# Altium schematic sheet 04 - Display.SchDoc
size A4; SheetNumber: 3; SheetTotal: 4; SchemaTitle: Overview
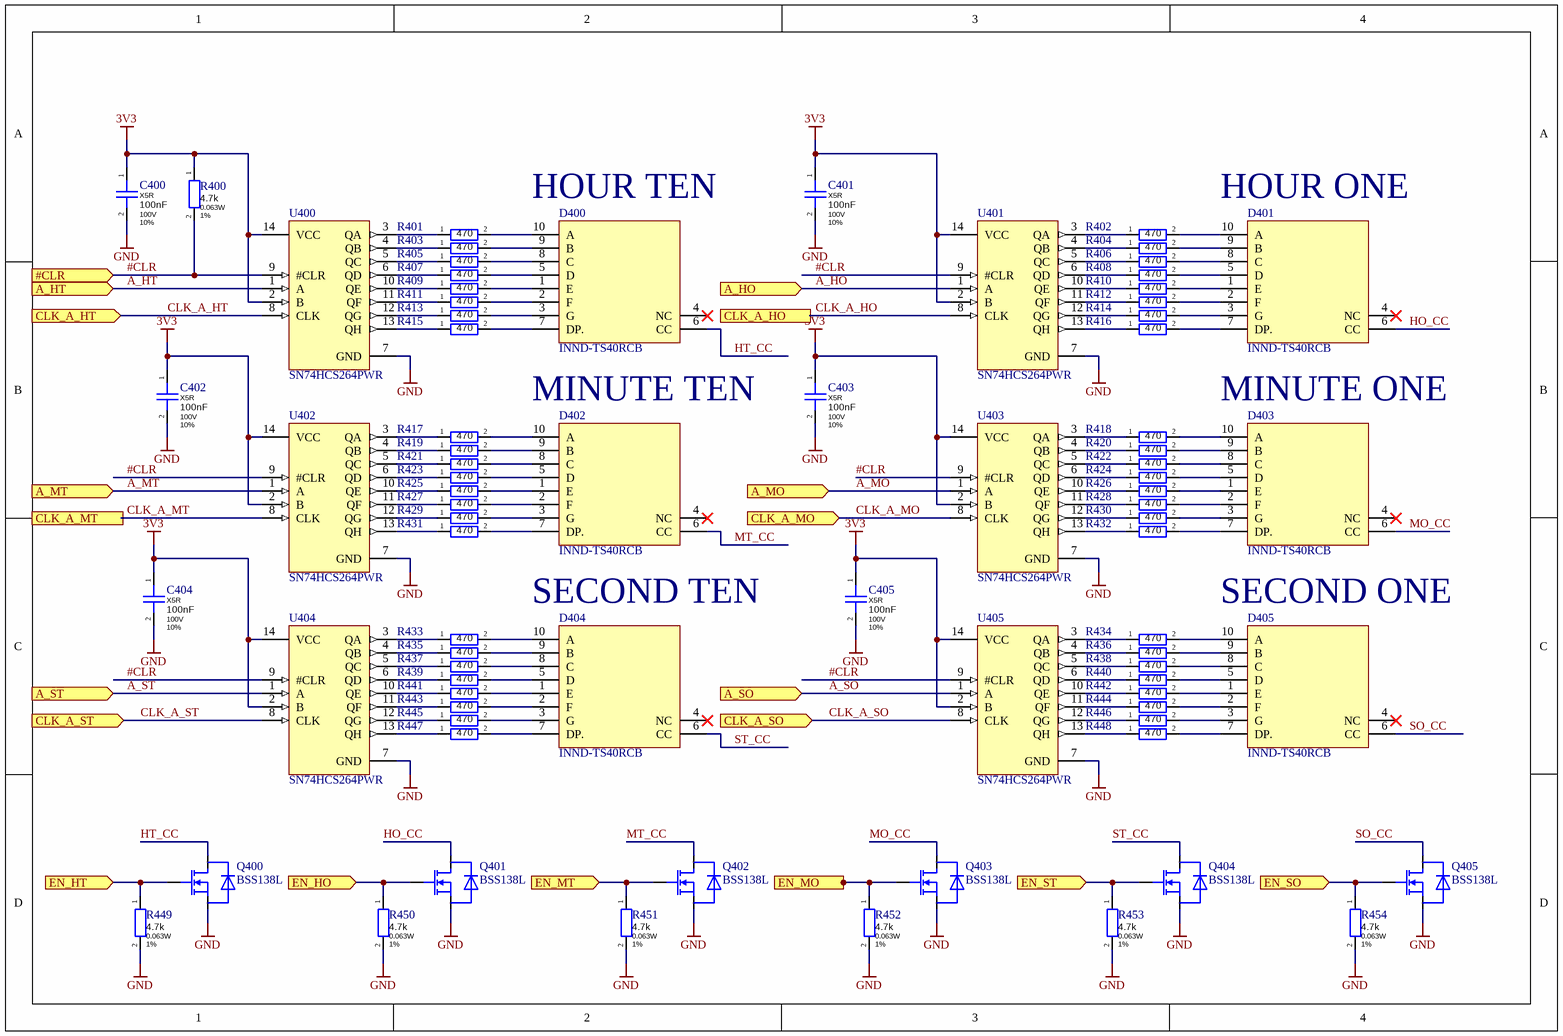
[diagram p0: 04 - Display.SchDoc]

## Parts
C400  Dielectric: X5R  Capacitance: 100nF  Voltage Rating: 100V  Tolerance: 10%  [CAPC0402(1005)60_L]  (hidden comment: GRM155R62A104KE14D)
C401  Dielectric: X5R  Capacitance: 100nF  Voltage Rating: 100V  Tolerance: 10%  [CAPC0402(1005)60_L]  (hidden comment: GRM155R62A104KE14D)
C402  Dielectric: X5R  Capacitance: 100nF  Voltage Rating: 100V  Tolerance: 10%  [CAPC0402(1005)60_L]  (hidden comment: GRM155R62A104KE14D)
C403  Dielectric: X5R  Capacitance: 100nF  Voltage Rating: 100V  Tolerance: 10%  [CAPC0402(1005)60_L]  (hidden comment: GRM155R62A104KE14D)
C404  Dielectric: X5R  Capacitance: 100nF  Voltage Rating: 100V  Tolerance: 10%  [CAPC0402(1005)60_L]  (hidden comment: GRM155R62A104KE14D)
C405  Dielectric: X5R  Capacitance: 100nF  Voltage Rating: 100V  Tolerance: 10%  [CAPC0402(1005)60_L]  (hidden comment: GRM155R62A104KE14D)
D400  INND-TS40RCB  [INND-TS40RCB-Footprint-1]
D401  INND-TS40RCB  [INND-TS40RCB-Footprint-1]
D402  INND-TS40RCB  [INND-TS40RCB-Footprint-1]
D403  INND-TS40RCB  [INND-TS40RCB-Footprint-1]
D404  INND-TS40RCB  [INND-TS40RCB-Footprint-1]
D405  INND-TS40RCB  [INND-TS40RCB-Footprint-1]
Q400  BSS138L  [SOT23-3]
Q401  BSS138L  [SOT23-3]
Q402  BSS138L  [SOT23-3]
Q403  BSS138L  [SOT23-3]
Q404  BSS138L  [SOT23-3]
Q405  BSS138L  [SOT23-3]
R400  Resistance: 4.7k  Power Rating: 0.063W  Tolerance: 1%  [RESC0402(1005)_L]  (hidden comment: RMCF0402FT4K70)
R401  Resistance: 470  [RESC0402(1005)_L]  (hidden comment: RMCF0402FT470R)
R402  Resistance: 470  [RESC0402(1005)_L]  (hidden comment: RMCF0402FT470R)
R403  Resistance: 470  [RESC0402(1005)_L]  (hidden comment: RMCF0402FT470R)
R404  Resistance: 470  [RESC0402(1005)_L]  (hidden comment: RMCF0402FT470R)
R405  Resistance: 470  [RESC0402(1005)_L]  (hidden comment: RMCF0402FT470R)
R406  Resistance: 470  [RESC0402(1005)_L]  (hidden comment: RMCF0402FT470R)
R407  Resistance: 470  [RESC0402(1005)_L]  (hidden comment: RMCF0402FT470R)
R408  Resistance: 470  [RESC0402(1005)_L]  (hidden comment: RMCF0402FT470R)
R409  Resistance: 470  [RESC0402(1005)_L]  (hidden comment: RMCF0402FT470R)
R410  Resistance: 470  [RESC0402(1005)_L]  (hidden comment: RMCF0402FT470R)
R411  Resistance: 470  [RESC0402(1005)_L]  (hidden comment: RMCF0402FT470R)
R412  Resistance: 470  [RESC0402(1005)_L]  (hidden comment: RMCF0402FT470R)
R413  Resistance: 470  [RESC0402(1005)_L]  (hidden comment: RMCF0402FT470R)
R414  Resistance: 470  [RESC0402(1005)_L]  (hidden comment: RMCF0402FT470R)
R415  Resistance: 470  [RESC0402(1005)_L]  (hidden comment: RMCF0402FT470R)
R416  Resistance: 470  [RESC0402(1005)_L]  (hidden comment: RMCF0402FT470R)
R417  Resistance: 470  [RESC0402(1005)_L]  (hidden comment: RMCF0402FT470R)
R418  Resistance: 470  [RESC0402(1005)_L]  (hidden comment: RMCF0402FT470R)
R419  Resistance: 470  [RESC0402(1005)_L]  (hidden comment: RMCF0402FT470R)
R420  Resistance: 470  [RESC0402(1005)_L]  (hidden comment: RMCF0402FT470R)
R421  Resistance: 470  [RESC0402(1005)_L]  (hidden comment: RMCF0402FT470R)
R422  Resistance: 470  [RESC0402(1005)_L]  (hidden comment: RMCF0402FT470R)
R423  Resistance: 470  [RESC0402(1005)_L]  (hidden comment: RMCF0402FT470R)
R424  Resistance: 470  [RESC0402(1005)_L]  (hidden comment: RMCF0402FT470R)
R425  Resistance: 470  [RESC0402(1005)_L]  (hidden comment: RMCF0402FT470R)
R426  Resistance: 470  [RESC0402(1005)_L]  (hidden comment: RMCF0402FT470R)
R427  Resistance: 470  [RESC0402(1005)_L]  (hidden comment: RMCF0402FT470R)
R428  Resistance: 470  [RESC0402(1005)_L]  (hidden comment: RMCF0402FT470R)
R429  Resistance: 470  [RESC0402(1005)_L]  (hidden comment: RMCF0402FT470R)
R430  Resistance: 470  [RESC0402(1005)_L]  (hidden comment: RMCF0402FT470R)
R431  Resistance: 470  [RESC0402(1005)_L]  (hidden comment: RMCF0402FT470R)
R432  Resistance: 470  [RESC0402(1005)_L]  (hidden comment: RMCF0402FT470R)
R433  Resistance: 470  [RESC0402(1005)_L]  (hidden comment: RMCF0402FT470R)
R434  Resistance: 470  [RESC0402(1005)_L]  (hidden comment: RMCF0402FT470R)
R435  Resistance: 470  [RESC0402(1005)_L]  (hidden comment: RMCF0402FT470R)
R436  Resistance: 470  [RESC0402(1005)_L]  (hidden comment: RMCF0402FT470R)
R437  Resistance: 470  [RESC0402(1005)_L]  (hidden comment: RMCF0402FT470R)
R438  Resistance: 470  [RESC0402(1005)_L]  (hidden comment: RMCF0402FT470R)
R439  Resistance: 470  [RESC0402(1005)_L]  (hidden comment: RMCF0402FT470R)
R440  Resistance: 470  [RESC0402(1005)_L]  (hidden comment: RMCF0402FT470R)
R441  Resistance: 470  [RESC0402(1005)_L]  (hidden comment: RMCF0402FT470R)
R442  Resistance: 470  [RESC0402(1005)_L]  (hidden comment: RMCF0402FT470R)
R443  Resistance: 470  [RESC0402(1005)_L]  (hidden comment: RMCF0402FT470R)
R444  Resistance: 470  [RESC0402(1005)_L]  (hidden comment: RMCF0402FT470R)
R445  Resistance: 470  [RESC0402(1005)_L]  (hidden comment: RMCF0402FT470R)
R446  Resistance: 470  [RESC0402(1005)_L]  (hidden comment: RMCF0402FT470R)
R447  Resistance: 470  [RESC0402(1005)_L]  (hidden comment: RMCF0402FT470R)
R448  Resistance: 470  [RESC0402(1005)_L]  (hidden comment: RMCF0402FT470R)
R449  Resistance: 4.7k  Power Rating: 0.063W  Tolerance: 1%  [RESC0402(1005)_L]  (hidden comment: RMCF0402FT4K70)
R450  Resistance: 4.7k  Power Rating: 0.063W  Tolerance: 1%  [RESC0402(1005)_L]  (hidden comment: RMCF0402FT4K70)
R451  Resistance: 4.7k  Power Rating: 0.063W  Tolerance: 1%  [RESC0402(1005)_L]  (hidden comment: RMCF0402FT4K70)
R452  Resistance: 4.7k  Power Rating: 0.063W  Tolerance: 1%  [RESC0402(1005)_L]  (hidden comment: RMCF0402FT4K70)
R453  Resistance: 4.7k  Power Rating: 0.063W  Tolerance: 1%  [RESC0402(1005)_L]  (hidden comment: RMCF0402FT4K70)
R454  Resistance: 4.7k  Power Rating: 0.063W  Tolerance: 1%  [RESC0402(1005)_L]  (hidden comment: RMCF0402FT4K70)
U400  SN74HCS264PWR  [TSSOP-14]
U401  SN74HCS264PWR  [TSSOP-14]
U402  SN74HCS264PWR  [TSSOP-14]
U403  SN74HCS264PWR  [TSSOP-14]
U404  SN74HCS264PWR  [TSSOP-14]
U405  SN74HCS264PWR  [TSSOP-14]

## Ports
#CLR (in), A_HO (in), A_HT (in), A_MO (in), A_MT (in), A_SO (in), A_ST (in), CLK_A_HO (in), CLK_A_HT (in), CLK_A_MO (in), CLK_A_MT (in), CLK_A_SO (in), CLK_A_ST (in), EN_HO (in), EN_HT (in), EN_MO (in), EN_MT (in), EN_SO (in), EN_ST (in)

## Nets
3V3: C400.1 C401.1 C402.1 C403.1 C404.1 C405.1 R400.1 U400.2(B) U400.14(VCC) U401.2(B) U401.14(VCC) U402.2(B) U402.14(VCC) U403.2(B) U403.14(VCC) U404.2(B) U404.14(VCC) U405.2(B) U405.14(VCC)
GND: C400.2 C401.2 C402.2 C403.2 C404.2 C405.2 Q400.2(S) Q401.2(S) Q402.2(S) Q403.2(S) Q404.2(S) Q405.2(S) R449.2 R450.2 R451.2 R452.2 R453.2 R454.2 U400.7(GND) U401.7(GND) U402.7(GND) U403.7(GND) U404.7(GND) U405.7(GND)
#CLR: R400.2 U400.9(#CLR) U401.9(#CLR) U402.9(#CLR) U403.9(#CLR) U404.9(#CLR) U405.9(#CLR) ; port #CLR
A_HO: U401.1(A) ; port A_HO
A_HT: U400.1(A) ; port A_HT
A_MO: U403.1(A) ; port A_MO
A_MT: U402.1(A) ; port A_MT
A_SO: U405.1(A) ; port A_SO
A_ST: U404.1(A) ; port A_ST
CLK_A_HO: U401.8(CLK) ; port CLK_A_HO
CLK_A_HT: U400.8(CLK) ; port CLK_A_HT
CLK_A_MO: U403.8(CLK) ; port CLK_A_MO
CLK_A_MT: U402.8(CLK) ; port CLK_A_MT
CLK_A_SO: U405.8(CLK) ; port CLK_A_SO
CLK_A_ST: U404.8(CLK) ; port CLK_A_ST
EN_HO: Q401.1(G) R450.1 ; port EN_HO
EN_HT: Q400.1(G) R449.1 ; port EN_HT
EN_MO: Q403.1(G) R452.1 ; port EN_MO
EN_MT: Q402.1(G) R451.1 ; port EN_MT
EN_SO: Q405.1(G) R454.1 ; port EN_SO
EN_ST: Q404.1(G) R453.1 ; port EN_ST
HO_CC: D401.6(CC) Q401.3(D)
HT_CC: D400.6(CC) Q400.3(D)
MO_CC: D403.6(CC) Q403.3(D)
MT_CC: D402.6(CC) Q402.3(D)
SO_CC: D405.6(CC) Q405.3(D)
ST_CC: D404.6(CC) Q404.3(D)
NetD400_1: D400.1(E) R409.2
NetD400_2: D400.2(F) R411.2
NetD400_3: D400.3(G) R413.2
NetD400_5: D400.5(D) R407.2
NetD400_7: D400.7(DP.) R415.2
NetD400_8: D400.8(C) R405.2
NetD400_9: D400.9(B) R403.2
NetD400_10: D400.10(A) R401.2
NetD401_1: D401.1(E) R410.2
NetD401_2: D401.2(F) R412.2
NetD401_3: D401.3(G) R414.2
NetD401_5: D401.5(D) R408.2
NetD401_7: D401.7(DP.) R416.2
NetD401_8: D401.8(C) R406.2
NetD401_9: D401.9(B) R404.2
NetD401_10: D401.10(A) R402.2
NetD402_1: D402.1(E) R425.2
NetD402_2: D402.2(F) R427.2
NetD402_3: D402.3(G) R429.2
NetD402_5: D402.5(D) R423.2
NetD402_7: D402.7(DP.) R431.2
NetD402_8: D402.8(C) R421.2
NetD402_9: D402.9(B) R419.2
NetD402_10: D402.10(A) R417.2
NetD403_1: D403.1(E) R426.2
NetD403_2: D403.2(F) R428.2
NetD403_3: D403.3(G) R430.2
NetD403_5: D403.5(D) R424.2
NetD403_7: D403.7(DP.) R432.2
NetD403_8: D403.8(C) R422.2
NetD403_9: D403.9(B) R420.2
NetD403_10: D403.10(A) R418.2
NetD404_1: D404.1(E) R441.2
NetD404_2: D404.2(F) R443.2
NetD404_3: D404.3(G) R445.2
NetD404_5: D404.5(D) R439.2
NetD404_7: D404.7(DP.) R447.2
NetD404_8: D404.8(C) R437.2
NetD404_9: D404.9(B) R435.2
NetD404_10: D404.10(A) R433.2
NetD405_1: D405.1(E) R442.2
NetD405_2: D405.2(F) R444.2
NetD405_3: D405.3(G) R446.2
NetD405_5: D405.5(D) R440.2
NetD405_7: D405.7(DP.) R448.2
NetD405_8: D405.8(C) R438.2
NetD405_9: D405.9(B) R436.2
NetD405_10: D405.10(A) R434.2
NetR401_1: R401.1 U400.3(QA)
NetR402_1: R402.1 U401.3(QA)
NetR403_1: R403.1 U400.4(QB)
NetR404_1: R404.1 U401.4(QB)
NetR405_1: R405.1 U400.5(QC)
NetR406_1: R406.1 U401.5(QC)
NetR407_1: R407.1 U400.6(QD)
NetR408_1: R408.1 U401.6(QD)
NetR409_1: R409.1 U400.10(QE)
NetR410_1: R410.1 U401.10(QE)
NetR411_1: R411.1 U400.11(QF)
NetR412_1: R412.1 U401.11(QF)
NetR413_1: R413.1 U400.12(QG)
NetR414_1: R414.1 U401.12(QG)
NetR415_1: R415.1 U400.13(QH)
NetR416_1: R416.1 U401.13(QH)
NetR417_1: R417.1 U402.3(QA)
NetR418_1: R418.1 U403.3(QA)
NetR419_1: R419.1 U402.4(QB)
NetR420_1: R420.1 U403.4(QB)
NetR421_1: R421.1 U402.5(QC)
NetR422_1: R422.1 U403.5(QC)
NetR423_1: R423.1 U402.6(QD)
NetR424_1: R424.1 U403.6(QD)
NetR425_1: R425.1 U402.10(QE)
NetR426_1: R426.1 U403.10(QE)
NetR427_1: R427.1 U402.11(QF)
NetR428_1: R428.1 U403.11(QF)
NetR429_1: R429.1 U402.12(QG)
NetR430_1: R430.1 U403.12(QG)
NetR431_1: R431.1 U402.13(QH)
NetR432_1: R432.1 U403.13(QH)
NetR433_1: R433.1 U404.3(QA)
NetR434_1: R434.1 U405.3(QA)
NetR435_1: R435.1 U404.4(QB)
NetR436_1: R436.1 U405.4(QB)
NetR437_1: R437.1 U404.5(QC)
NetR438_1: R438.1 U405.5(QC)
NetR439_1: R439.1 U404.6(QD)
NetR440_1: R440.1 U405.6(QD)
NetR441_1: R441.1 U404.10(QE)
NetR442_1: R442.1 U405.10(QE)
NetR443_1: R443.1 U404.11(QF)
NetR444_1: R444.1 U405.11(QF)
NetR445_1: R445.1 U404.12(QG)
NetR446_1: R446.1 U405.12(QG)
NetR447_1: R447.1 U404.13(QH)
NetR448_1: R448.1 U405.13(QH)

Not connected (* = marked no-connect by the designer): D400 4(NC)*; D401 4(NC)*; D402 4(NC)*; D403 4(NC)*; D404 4(NC)*; D405 4(NC)*

## Notes on the sheet
- (near D400) HOUR TEN
- (near D401) HOUR ONE
- MINUTE TEN
- MINUTE ONE
- SECOND TEN
- SECOND ONE
- Schema Title:
- Project:
- Revision:
- Author:
- PCB Name:
- Date:
- Time:
- Sheet:
- of
- Doc Name:
- A4

## Library data of the parts
C400-C405 = CMP-00636-01: 0.1µF ±10% 100V Ceramic Capacitor X5R 0402 (1005 Metric); Manufacturer: Murata Electronics; RoHS Compliant: Yes; Mount: Surface Mount; Max Operating Temperature: 85°C; Min Operating Temperature: -55°C; Supplier Part Number 1: 490-10458-1-ND; Case/Package: 0402; Length: 0.039inch; Manufacturer Part Number: GRM155R62A104KE14D; Termination: SMD/SMT; Thickness: 0.022inch; ComponentLink1Description: Datasheet; Packaging: Tape and Reel; Height: 0.5mm; Package Quantity: 10000; Supplier 1: Digi-Key; Case Code (Imperial): 0402; Lead Free: Lead Free; Case Code (Metric): 1005; Voltage Rating (DC): 100V; Width: 0.5mm; Weight: 0.000212oz; REACH SVHC: No SVHC
D400-D405 = CMP-02011-01: Display Modules - LED Character and Numeric Red 7-Segment 1 Character Common Cathode 2V 20mA 0.508" H x 0.379" W x 0.250" D (12.90mm x 9.63mm x 6.36mm) 10-DIP (0.300", 7.62mm); Manufacturer: Inolux; ComponentLink1URL: https://www.inolux-corp.com/datasheet/Display/Through-Hole-Display/SingleDigit/INND-TS40%20Series_V1.0.pdf; Supplier Part Number 1: 1830-1155-ND; Supplier 1: Digi-Key; Manufacturer Part Number: INND-TS40RCB; ComponentLink1Description: Datasheet
Q400-Q405 = CMP-00239-05: MOSFET N-CH 50V 200MA SOT-23; Manufacturer: ON Semiconductor; Turn-On Delay Time: 2.2ns; Input Capacitance: 50pF; Max Power Dissipation: 350mW; Gate to Source Voltage (Vgs): 20V; Fall Time: 5.1ns; Rise Time: 1.8ns; Drain to Source Resistance: 3.5R; Element Configuration: Single; Number of Channels: 1; Turn-Off Delay Time: 5.3ns; Threshold Voltage: 1.25V; Drain to Source Breakdown Voltage: 50V; Package Quantity: 3000; Manufacturer Part Number: BSS138L; ComponentLink1URL: https://www.onsemi.com/pdf/datasheet/bss138l-d.pdf; Min Operating Temperature: -55°C; Continuous Drain Current (ID): 200mA; Supplier Part Number 1: BSS138LCT-ND; ComponentLink1Description: Datasheet; Weight: 0.03g; Supplier 1: Digikey; REACH SVHC: No SVHC; Case/Package: SOT-23-3; Drain to Source Voltage (Vdss): 50V; Packaging: Tape and Reel; Rds On Max: 3.5R; Max Operating Temperature: 150°C; Mount: Surface Mount; Number of Pins: 3
R400 R449-R454 = CMP-00490-01: 4.7 kOhms ±1% 0.063W, 1/16W Chip Resistor 0402 (1005 Metric) Automotive AEC-Q200 Thick Film; Manufacturer: Stackpole Electronics Inc; Max Power Dissipation: 63mW; Temperature Coefficient: 100ppm/°C; Case Code (Metric): 1005; Case Code (Imperial): 0402; Min Operating Temperature: -55°C; Supplier Part Number 1: RMCF0402FT4K70CT-ND; Radiation Hardening: No; Width: 0.02inch; Depth: 0.5mm; Supplier 1: Digi-Key; Case/Package: 0402; Length: 1mm; Lead Free: Lead Free; Height: 0.016inch; Max Operating Temperature: 155°C; Features: Automotive AEC-Q200; Number of Terminations: 2; Resistor Type: Thick Film; Contact Plating: Tin,Matte; Military Standard: Not; Manufacturer Part Number: RMCF0402FT4K70; Mount: Surface Mount; Packaging: Tape and Reel; ComponentLink1Description: Datasheet
R401-R448 = CMP-00454-01: 470 Ohms ±1% 0.063W, 1/16W Chip Resistor 0402 (1005 Metric) Automotive AEC-Q200 Thick Film; Manufacturer: Stackpole Electronics Inc; Power Rating: 63mW; Temperature Coefficient: 100ppm/°C; Tolerance: 1%; Resistor Type: Thick Film; Packaging: Tape and Reel; Max Operating Temperature: 155°C; Height: 0.016inch; Manufacturer Part Number: RMCF0402FT470R; Radiation Hardening: No; Number of Terminations: 2; Contact Plating: Tin,Matte; Case Code (Metric): 1005; Case/Package: 0402; ComponentLink1Description: Datasheet; Supplier Part Number 1: 738-RMCF0402FT470RCT-ND; Supplier 1: Digi-Key; Length: 0.039inch; Mount: Surface Mount; Case Code (Imperial): 0402; Features: Automotive AEC-Q200; Width: 0.02inch; Max Power Dissipation: 63mW; Min Operating Temperature: -55°C
U400-U405 = CMP-02018-01: Shift Shift Register 1 Element 8 Bit 14-TSSOP; Manufacturer: Texas Instruments; ComponentLink1Description: Datasheet; Supplier 1: Digi-Key; Supplier Part Number 1: 296-SN74HCS264PWRCT-ND; ComponentLink1URL: https://www.ti.com/lit/ds/symlink/sn74hcs264.pdf; Manufacturer Part Number: SN74HCS264PWR